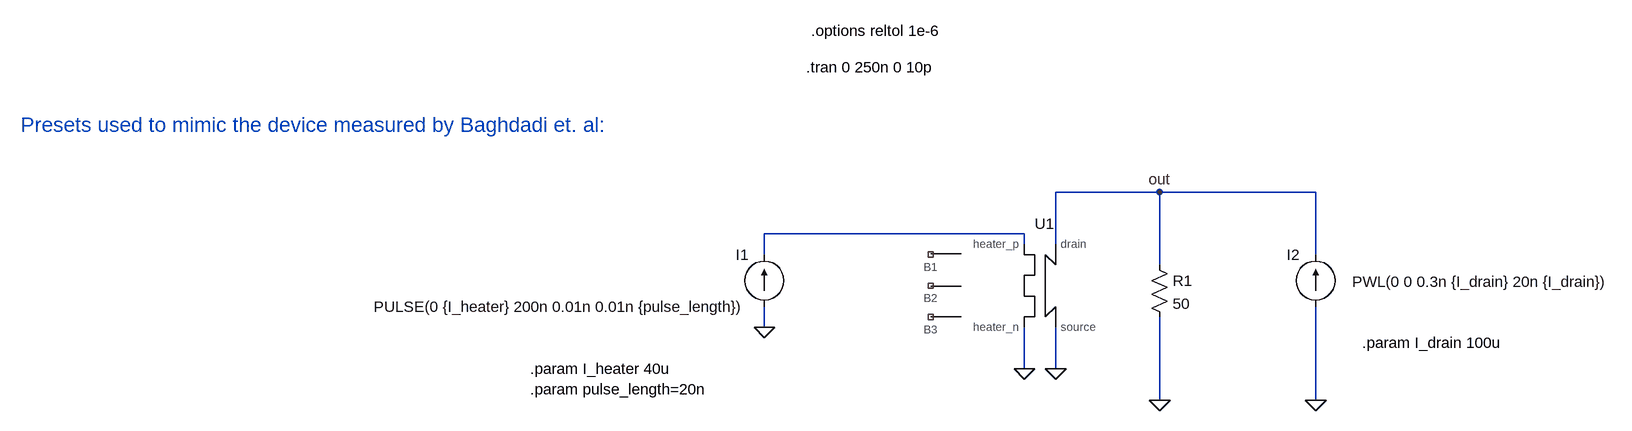
[diagram p0: schematic test_circuit_pulse.asc]
test_circuit_pulse.asc, the LTspice schematic file:
Version 4.1
SHEET 1 1964 1228
WIRE 336 32 176 32
WIRE 576 32 336 32
WIRE 128 96 -272 96
WIRE 128 112 128 96
WIRE 176 112 176 32
WIRE -272 128 -272 96
WIRE 576 128 576 32
WIRE 336 144 336 32
WIRE -272 240 -272 208
WIRE 128 304 128 240
WIRE 176 304 176 240
WIRE 336 352 336 224
WIRE 576 352 576 208
FLAG -272 240 0
FLAG 176 304 0
FLAG 576 352 0
FLAG 336 32 out
FLAG 128 304 0
FLAG 336 352 0
SYMBOL current -272 208 R180
WINDOW 0 24 80 Left 2
WINDOW 3 24 0 Left 2
WINDOW 123 0 0 Left 0
WINDOW 39 0 0 Left 0
SYMATTR InstName I1
SYMATTR Value PULSE(0 {I_heater} 200n 0.01n 0.01n {pulse_length})
SYMBOL current 576 208 R180
WINDOW 0 24 80 Left 2
WINDOW 3 -455 38 Left 2
WINDOW 123 0 0 Left 0
WINDOW 39 0 0 Left 0
SYMATTR InstName I2
SYMATTR Value PWL(0 0 0.3n {I_drain} 20n {I_drain})
SYMBOL res 320 128 R0
SYMATTR InstName R1
SYMATTR Value 50
SYMBOL hTron_behavioral 192 176 R0
SYMATTR SpiceLine ""
SYMATTR InstName U1
TEXT 648 264 Left 2 !.param I_drain 100u
TEXT -208 -160 Left 2 !.tran 0 250n 0 10p
TEXT -632 304 Left 2 !.param I_heater 40u\n.param pulse_length=20n
TEXT -200 -216 Left 2 !.options reltol 1e-6
TEXT -1416 -72 Left 3 ;Presets used to mimic the device measured by Baghdadi et. al:

The netlist it stands for:
* test_circuit_pulse.asc
I1 0 N001 PULSE(0 {I_heater} 200n 0.01n 0.01n {pulse_length})
I2 0 out PWL(0 0 0.3n {I_drain} 20n {I_drain})
R1 out 0 50
X§U1 N001 0 out 0 NC_01 NC_02 NC_03 hTron_behav  ; pins heater_p heater_n drain source B1 B2 B3
.param I_drain 100u
.tran 0 250n 0 10p
.param I_heater 40u
.param pulse_length=20n
.options reltol 1e-6
* Presets used to mimic the device measured by Baghdadi et. al:
.lib hTron_behavioral.lib
.backanno
.end